# Altium schematic sheet Power Supply Section.SchDoc
size A3
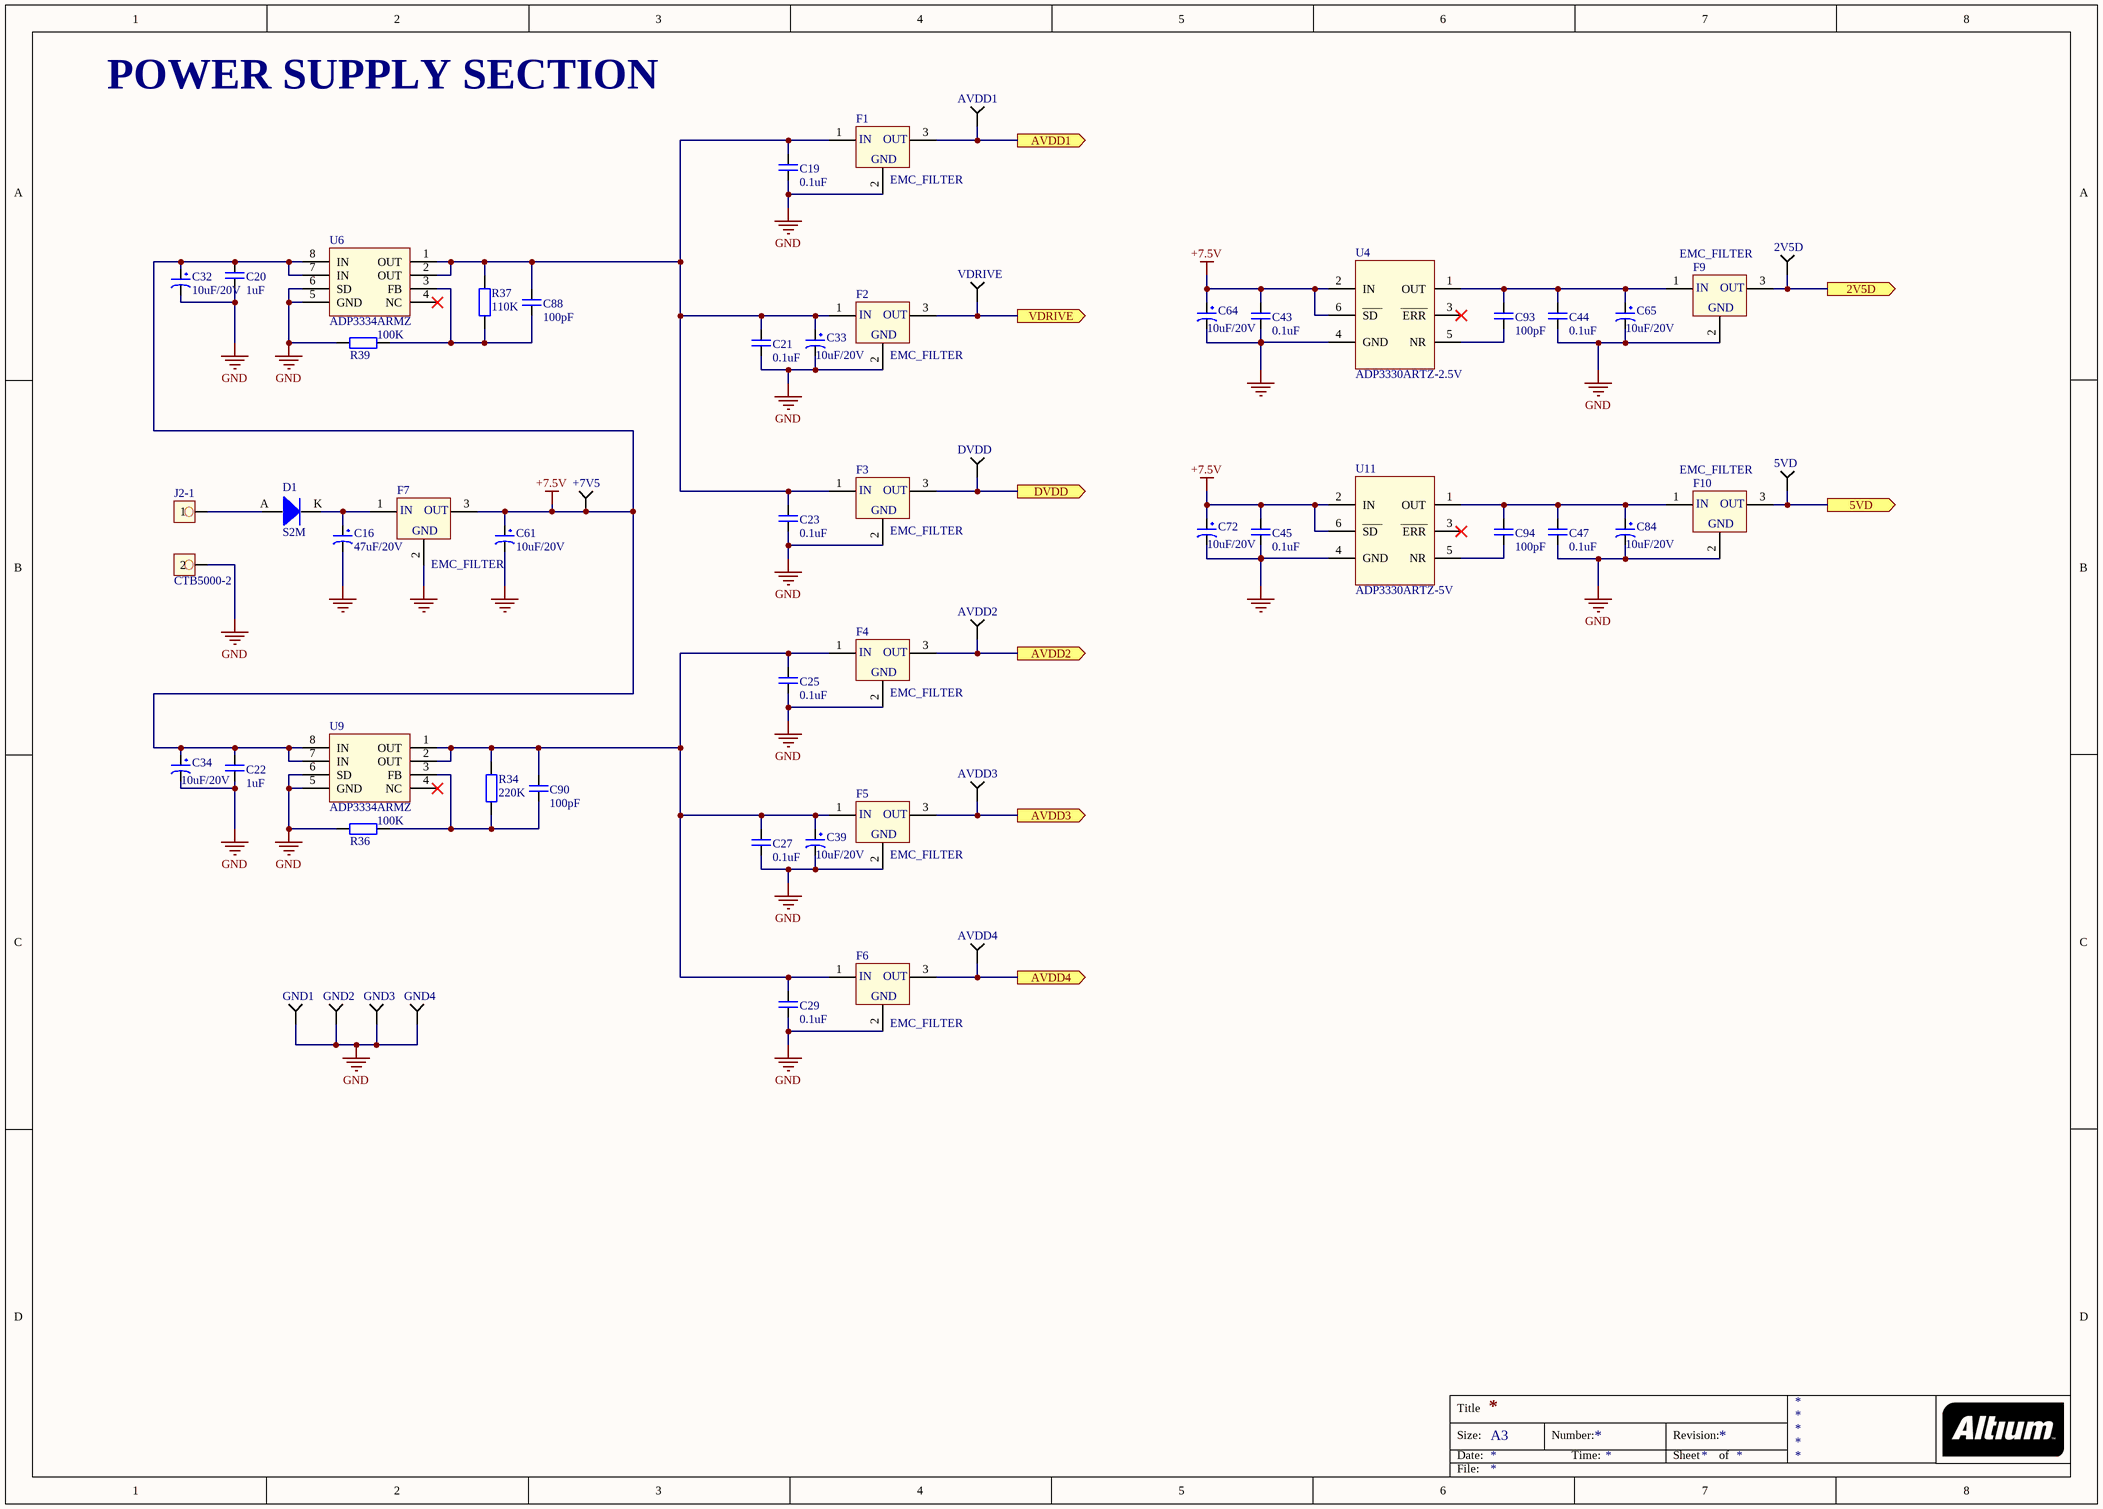
[diagram p0: Power Supply Section.SchDoc]

## Parts
2V5D  Test point  [Test Point]  (value not drawn)
5VD  Test point  [Test Point]  (value not drawn)
+7V5  Test point  [Test Point]  (value not drawn)
AVDD1  Test point  [Test Point]  (value not drawn)
AVDD2  Test point  [Test Point]  (value not drawn)
AVDD3  Test point  [Test Point]  (value not drawn)
AVDD4  Test point  [Test Point]  (value not drawn)
C16  47uF/20V  [C_TANTA_TAJ-D]
C19  0.1uF  [C_0805]
C20  1uF  [C_0805]
C21  0.1uF  [C_0805]
C22  1uF  [C_0805]
C23  0.1uF  [C_0805]
C25  0.1uF  [C_0805]
C27  0.1uF  [C_0805]
C29  0.1uF  [C_0805]
C32  10uF/20V  [C_TANTA_TAJ-B]
C33  10uF/20V  [C_TANTA_TAJ-B]
C34  10uF/20V  [C_TANTA_TAJ-B]
C39  10uF/20V  [C_TANTA_TAJ-B]
C43  0.1uF  [C_0805]
C44  0.1uF  [C_0805]
C45  0.1uF  [C_0805]
C47  0.1uF  [C_0805]
C61  10uF/20V  [C_TANTA_TAJ-B]
C64  10uF/20V  [C_TANTA_TAJ-B]
C65  10uF/20V  [C_TANTA_TAJ-B]
C72  10uF/20V  [C_TANTA_TAJ-B]
C84  10uF/20V  [C_TANTA_TAJ-B]
C88  100pF  [C0603]
C90  100pF  [C0603]
C93  100pF  [C0603]
C94  100pF  [C0603]
D1  S2M  [SS14_AK]
DVDD  Test point  [Test Point]  (value not drawn)
F1  EMC_FILTER  [EMC_FILTER]
F2  EMC_FILTER  [EMC_FILTER]
F3  EMC_FILTER  [EMC_FILTER]
F4  EMC_FILTER  [EMC_FILTER]
F5  EMC_FILTER  [EMC_FILTER]
F6  EMC_FILTER  [EMC_FILTER]
F7  EMC_FILTER  [EMC_FILTER]
F9  EMC_FILTER  [EMC_FILTER]
F10  EMC_FILTER  [EMC_FILTER]
GND1  Test point  [Test Point]  (value not drawn)
GND2  Test point  [Test Point]  (value not drawn)
GND3  Test point  [Test Point]  (value not drawn)
GND4  Test point  [Test Point]  (value not drawn)
J2-1  CTB5000-2  [CTB5000-2]
R34  220K  [R_0603]
R36  100K  [R_0603]
R37  110K  [R_0603]
R39  100K  [R_0603]
U4  ADP3330ARTZ-2.5V  [SOT-23-6]
U6  ADP3334ARMZ  [MSOP-8]
U9  ADP3334ARMZ  [MSOP-8]
U11  ADP3330ARTZ-5V  [SOT-23-6]
VDRIVE  Test point  [Test Point]  (value not drawn)

## Ports
2V5D (out), 5VD (out), AVDD1 (out), AVDD2 (out), AVDD3 (out), AVDD4 (out), DVDD (out), VDRIVE (out)

## Nets
+7.5V: +7V5.1 C20.1 C22.1 C32.1 C34.1 C43.1 C45.1 C61.1 C64.1 C72.1 F7.3(OUT) U4.2(IN) U4.6(SD) U6.7(IN) U6.8(IN) U9.7(IN) U9.8(IN) U11.2(IN) U11.6(SD)
GND: C19.2 C20.2 C21.2 C22.2 C23.2 C25.2 C27.2 C29.2 C32.2 C33.2 C34.2 C39.2 C44.2 C47.2 C65.2 C84.2 F1.2(GND) F2.2(GND) F3.2(GND) F4.2(GND) F5.2(GND) F6.2(GND) F9.2(GND) F10.2(GND) GND1.1 GND2.1 GND3.1 GND4.1 J2-1.2 R36.1 R39.1 U6.5(GND) U6.6(SD) U9.5(GND) U9.6(SD)
NetC16_2: C16.2 C43.2 C45.2 C61.2 C64.2 C72.2 F7.2(GND) U4.4(GND) U11.4(GND)
2V5D: 2V5D.1 F9.3(OUT) ; port 2V5D
5VD: 5VD.1 F10.3(OUT) ; port 5VD
AVDD1: AVDD1.1 F1.3(OUT) ; port AVDD1
AVDD2: AVDD2.1 F4.3(OUT) ; port AVDD2
AVDD3: AVDD3.1 F5.3(OUT) ; port AVDD3
AVDD4: AVDD4.1 F6.3(OUT) ; port AVDD4
DVDD: DVDD.1 F3.3(OUT) ; port DVDD
VDRIVE: F2.3(OUT) VDRIVE.1 ; port VDRIVE
NetC16_1: C16.1 D1.K F7.1(IN)
NetC19_1: C19.1 C21.1 C23.1 C33.1 C88.1 F1.1(IN) F2.1(IN) F3.1(IN) R37.2 U6.1(OUT) U6.2(OUT)
NetC25_1: C25.1 C27.1 C29.1 C39.1 C90.1 F4.1(IN) F5.1(IN) F6.1(IN) R34.2 U9.1(OUT) U9.2(OUT)
NetC44_1: C44.1 C65.1 C93.1 F9.1(IN) U4.1(OUT)
NetC47_1: C47.1 C84.1 C94.1 F10.1(IN) U11.1(OUT)
NetC88_2: C88.2 R37.1 R39.2 U6.3(FB)
NetC90_2: C90.2 R34.1 R36.2 U9.3(FB)
NetC93_2: C93.2 U4.5(NR)
NetC94_2: C94.2 U11.5(NR)
NetD1_A: D1.A J2-1.1

Not connected (* = marked no-connect by the designer): U4 3(ERR)*; U6 4(NC)*; U9 4(NC)*; U11 3(ERR)*

## Notes on the sheet
- POWER SUPPLY SECTION
- Title
- Size:
- Date:
- A3
- Number:
- Time:
- Revision:
- Sheet
- of
- File:

## Library data of the parts
2V5D 5VD +7V5 AVDD1-AVDD4 DVDD GND1-GND4 VDRIVE = Testpoint_PIN: CONN HEADER VERT .100 1POS 30AU; Manufacturer: TE Connectivity AMP Connectors; Manufacturer Part Number: 87220-1; Connector Type: Header, Unshrouded; Number of Positions: 1; Number of Positions Loaded: All; Pitch: 0.100" (2.54mm); Supplier 1: Digi-Key; RoHS: RoHS Compliant; Category: Connectors, Interconnects; Stock 1: 0; Pricing 1: 1=1.1, 25=1.04, 50=0.979, 100=0.847, 500=0.78, 1000=0.611, 2500=0.585 (USD); Packaging: Bulk; Contact Type: Male Pin; Number of Rows: 1; Row Spacing: -; Contact Mating Length: 0.318" (8.08mm); Mounting Type: Through Hole; Termination: Solder; Fastening Type: -; Features: -; Contact Finish: Gold; Contact Finish Thickness: 30µin (0.76µm); Color: Black; ComponentLink1URL: http://www.te.com/commerce/DocumentDelivery/DDEController?Action=srchrtrv&DocNm=87220&DocType=Customer+Drawing&DocLang=English; ComponentLink1Description: http://www.te.com/commerce/DocumentDelivery/DDEController?Action=srchrtrv&DocNm=87220&DocType=Customer+Drawing&DocLang=English; Supplier Part Number 1: A26540-ND
C16 = C_TANTA_47uF_20V: CAP TANT 47UF 20V 10% 2917_TAJ-D; Manufacturer: AVX Corporation; Manufacturer Part Number: TAJD476K020RNJ; Manufacturer Size Code: D; Capacitance: 47µF; ESR (Equivalent Series Resistance): 900 mOhm; Type: Molded; Value: 47uF/20V; Voltage - Rated: 20V; Supplier 1: Digi-Key; RoHS: RoHS Compliant; Category: Capacitors; Stock 1: 8382; Pricing 1: 1=1.07, 10=0.893, 100=0.57, 250=0.475 (USD); Packaging: Cut Tape (CT); Tolerance: ±10%; Operating Temperature: -55°C ~ 125°C; Mounting Type: Surface Mount; Package / Case: 2917 (7343 Metric); Size / Dimension: 0.287" L x 0.169" W (7.30mm x 4.30mm); Height - Seated (Max): 0.122" (3.10mm); Lead Spacing: -; Features: General Purpose; Lifetime @ Temp.: -; ComponentLink1URL: http://www.avx.com/docs/Catalogs/taj.pdf; ComponentLink1Description: http://www.avx.com/docs/Catalogs/taj.pdf; Supplier Part Number 1: 478-3936-1-ND
C19 C21 C23 C25 C27 C29 C43-C45 C47 = C_0.1uF_0805: CAP CER 0.1UF 50V 10% X7R 0805; Manufacturer: MULTICOMP; Manufacturer Part Number: MCU0805R104KCT; Value: 0.1uF/50V; Voltage - Rated: 50V; Supplier 1: Farnell; RoHS: YES; Stock 1: 722514; Pricing 1: 10=0.0642, 100=0.0449, 500=0.0323, 1000=0.0219, 4000=0.0174, 8000=0.014 (GBP); ComponentLink1URL: http://www.farnell.com/datasheets/1859359.pdf; ComponentLink1Description: http://www.farnell.com/datasheets/1859359.pdf; ComponentLink2URL: http://www.farnell.com/cad/1559055.zip; ComponentLink2Description: http://www.farnell.com/cad/1559055.zip; Supplier Part Number 1: 9406387
C20 = C_1uF: CAP CER 1UF 16V 10% X7R 0805; Manufacturer: Murata Electronics North America; Manufacturer Part Number: GRM21BR71C105KA01L; Value: 1uF/16V; Capacitance: 1µF; Supplier 1: Digi-Key; RoHS: RoHS Compliant; Category: Capacitors; Stock 1: 90000; Pricing 1: 3000=0.02139, 6000=0.01957, 9000=0.0182, 15000=0.01729, 30000=0.01638, 75000=0.01502, 150000=0.0124 (USD); Packaging: Tape & Reel (TR); Tolerance: ±10%; Voltage - Rated: 16V; Temperature Coefficient: X7R; Mounting Type: Surface Mount, MLCC; Operating Temperature: -55°C ~ 125°C; Applications: General Purpose; Ratings: -; Package / Case: 0805 (2012 Metric); Size / Dimension: 0.079" L x 0.049" W (2.00mm x 1.25mm); Height - Seated (Max): -; Thickness (Max): 0.053" (1.35mm); Lead Spacing: -; Features: -; Lead Style: -; ComponentLink1URL: http://www.murata.com/~/media/webrenewal/support/library/catalog/products/capacitor/mlcc/c02e.ashx; ComponentLink1Description: http://www.murata.com/~/media/webrenewal/support/library/catalog/products/capacitor/mlcc/c02e.ashx; Supplier Part Number 1: 490-1691-2-ND
C22 = C_1uF_0805: CAP CER 1UF 16V 10% X7R 0805; Manufacturer: Murata Electronics North America; Manufacturer Part Number: GRM21BR71C105KA01L; Value: 1uF/16V; Capacitance: 1µF; Supplier 1: Digi-Key; RoHS: RoHS Compliant; Category: Capacitors; Stock 1: 90000; Pricing 1: 3000=0.02139, 6000=0.01957, 9000=0.0182, 15000=0.01729, 30000=0.01638, 75000=0.01502, 150000=0.0124 (USD); Packaging: Tape & Reel (TR); Tolerance: ±10%; Voltage - Rated: 16V; Temperature Coefficient: X7R; Mounting Type: Surface Mount, MLCC; Operating Temperature: -55°C ~ 125°C; Applications: General Purpose; Ratings: -; Package / Case: 0805 (2012 Metric); Size / Dimension: 0.079" L x 0.049" W (2.00mm x 1.25mm); Height - Seated (Max): -; Thickness (Max): 0.053" (1.35mm); Lead Spacing: -; Features: -; Lead Style: -; ComponentLink1URL: http://www.murata.com/~/media/webrenewal/support/library/catalog/products/capacitor/mlcc/c02e.ashx; ComponentLink1Description: http://www.murata.com/~/media/webrenewal/support/library/catalog/products/capacitor/mlcc/c02e.ashx; Supplier Part Number 1: 490-1691-2-ND
C32-C34 C39 C61 C64 C65 C72 C84 = C_TANTA_10uF_20V: CAP TANT 10UF 20V 10% 1210; Manufacturer: AVX Corporation; Manufacturer Part Number: TAJB106K020RNJ; Manufacturer Size Code: B; Capacitance: 10µF; ESR (Equivalent Series Resistance): 2.1 Ohm; Type: Molded; Value: 10uF/20V; Supplier 1: Digi-Key; RoHS: RoHS Compliant; Category: Capacitors; Stock 1: 78000; Pricing 1: 2000=0.16, 4000=0.15, 10000=0.14, 14000=0.1375, 50000=0.13, 100000=0.125 (USD); Packaging: Tape & Reel (TR); Tolerance: ±10%; Voltage - Rated: 20V; Operating Temperature: -55°C ~ 125°C; Mounting Type: Surface Mount; Package / Case: 1210 (3528 Metric); Size / Dimension: 0.138" L x 0.110" W (3.50mm x 2.80mm); Height - Seated (Max): 0.083" (2.10mm); Lead Spacing: -; Features: General Purpose; Lifetime @ Temp.: -; ComponentLink1URL: http://www.avx.com/docs/Catalogs/taj.pdf; ComponentLink1Description: http://www.avx.com/docs/Catalogs/taj.pdf; Supplier Part Number 1: 478-1674-2-ND
C88 C90 C93 C94 = C_100pF_0603: CAP CER 100PF 50V 5% NP0 0603; Manufacturer: MULTICOMP; Manufacturer Part Number: MCU0603C101JCT; Value: 100pF/50V; Capacitance: 100; Dielectric Characteristic: C0G / NP0; Voltage Rating: 50; Ceramic Capacitor Case: 0603 [1608 Metric]; SVHC: No SVHC (15-Jun-2015); Capacitor Terminals: SMD; Voltage - Rated: 50V; Supplier 1: Farnell; RoHS: YES; Stock 1: 203451; Pricing 1: 10=0.0231, 100=0.015, 500=0.0105, 1000=0.0081, 4000=0.0068, 8000=0.0058 (GBP); Product Range: -; Capacitance Tolerance: ± 5%; Operating Temperature Min: -55; Operating Temperature Max: 125; Packaging: Cut Tape; MSL: -; Capacitance Tolerance ±: ± 5%; Operating Temperature Range: -55°C to +125; ComponentLink1URL: http://www.farnell.com/datasheets/1723231.pdf; ComponentLink1Description: http://www.farnell.com/datasheets/1723231.pdf; Supplier Part Number 1: 9406115
D1 = D_S2M: DIODE GEN PURP 1KV 2A DO214AA; Manufacturer: Fairchild Semiconductor; Value: 2A/DO214AA; Diode Type: Standard; Voltage - DC Reverse (Vr) (Max): 1000V (1kV); Voltage - Forward (Vf) (Max) @ If: 1.15V @ 2A; Speed: Standard Recovery >500ns, > 200mA (Io); Reverse Recovery Time (trr): 2µs; Current - Reverse Leakage @ Vr: 1µA @ 1000V; Capacitance @ Vr, F: 30pF @ 4V, 1MHz; Supplier 1: Digi-Key; Manufacturer Part Number: S2M; RoHS: RoHS Compliant; Category: Discrete Semiconductor Products; Stock 1: 14925; Pricing 1: 1=0.56, 10=0.406, 25=0.3156, 100=0.2391, 250=0.16908, 500=0.13534, 1000=0.10381 (USD); Packaging: Digi-Reel®; Current - Average Rectified (Io): 2A; Mounting Type: Surface Mount; Package / Case: DO-214AA, SMB; Supplier Device Package: DO-214AA (SMB); Operating Temperature - Junction: -65°C ~ 150°C; ComponentLink1URL: http://www.fairchildsemi.com/datasheets/S2/S2A.pdf; ComponentLink1Description: http://www.fairchildsemi.com/datasheets/S2/S2A.pdf; Supplier Part Number 1: S2MFSDKR-ND
F1-F7 F9 F10 = EMC_FILTER: FILTER LC HIGH FREQ 1000PF 2606; Manufacturer: Murata Electronics North America; Manufacturer Part Number: NFE61PT102E1H9L; Type: Low Pass; Number of Channels: 1; Current: 2A; Values: C = 1000pF; ESD Protection: No; Filter Order: 2nd; Supplier 1: Digi-Key; RoHS: RoHS Compliant; Category: Filters; Stock 1: 24285; Pricing 1: 1=0.71, 10=0.681, 25=0.6588, 50=0.538, 100=0.483, 250=0.43912, 500=0.41716, 1000=0.37325 (USD); Packaging: Cut Tape (CT); Technology: LC (T-Type); Center / Cutoff Frequency: -; Attenuation Value: -; Resistance - Channel (Ohms): -; Applications: General Purpose; Package / Case: 2706 (6816 Metric), 3 PC Pad; Size / Dimension: 0.268" L x 0.063" W (6.80mm x 1.60mm); Height: 0.075" (1.90mm); Operating Temperature: -40°C ~ 85°C; ComponentLink1URL: http://www.murata.com/en-sg/products/productdata/ENFE0003.pdf?context=bWFzdGVyfE0wM1h8MTY2NTY1fGFwcGxpY2F0aW9uL3BkZnxzeXMtbWFzdGVyL00wM1gvaGI2L2hkOC84Nzk2MzQwNDIwNjM4L0VORkUwMDAzLnBkZnxjMWNlOTY5YWIyMTllYmFlYmYxMzUyZGE0MWEzYzljNGU2ZTUwYmU1MzU5MTg0ZTlhY2Y2M; ComponentLink1Description: http://www.murata.com/en-sg/products/productdata/ENFE0003.pdf?context=bWFzdGVyfE0wM1h8MTY2NTY1fGFwcGxpY2F0aW9uL3BkZnxzeXMtbWFzdGVyL00wM1gvaGI2L2hkOC84Nzk2MzQwNDIwNjM4L0VORkUwMDAzLnBkZnxjMWNlOTY5YWIyMTllYmFlYmYxMzUyZGE0MWEzYzljNGU2ZTUwYmU1MzU5MTg0ZTlhY2Y2M; Supplier Part Number 1: 490-2553-1-ND
J2-1 = HEADER_2: TERMINAL BLOCK, WIRE TO BRD, 2POS, 14AWG; Manufacturer: CAMDENBOSS; Manufacturer Part Number: CTB5000/2; Connector Type: Terminal Block, PCB; Connector Mounting: PCB; Pitch Spacing: 5; SVHC: No SVHC (17-Dec-2014); Block Orientation: Through Hole Right Angle; Conductor Area CSA: 1.5; External Depth: 7.50; External Length / Height: 10; No. of Positions: 2; Pin Diameter: 1; RMS Current (Irms): 16; Rated Voltage: 250; Wire Connection Method: Screw<!--FANDB--><div class="features-and-benefits-container"><div class="features-and-benefits-description"><span class="features-benefits-value">The CTB5000/2 is a 2-pole ultra low profile screw Terminal Block with anti-solder wicking terminals.</span></div><div class="features-and-benefits-list"><ul class="features-and-benefits-list-list"><li class="features-and-benefits-list-item">Test Probe Facility</li><li class="features-and-benefits-list-item">Moulded in Grey UL94-V0 Flame Retardant PC</li><li class="features-and-benefits-list-item">0.5 to 1.0mm² (30 to 14; Supplier 1: Farnell; RoHS: YES; Stock 1: 31858; Pricing 1: 5=0.524, 10=0.273, 50=0.26, 100=0.209, 500=0.18, 1000=0.155, 3000=0.14, 8000=0.122 (GBP); Wire Size AWG Min: -; Wire Size AWG Max: -; Contact Plating: Tin; Contact Material: Brass; Colour: Light Grey; External Width: 5; Flammability Rating: UL94V-0; Height: 10; Operating Temperature Max: 125; Operating Temperature Min: -20; Rated Current: 16; Voltage Rating V AC: 250; Wire Area Size Max: 1.5; ComponentLink1URL: http://www.farnell.com/datasheets/1927438.pdf; ComponentLink1Description: http://www.farnell.com/datasheets/1927438.pdf; Supplier Part Number 1: 151789
R34 = R_0603_220K: RES SMD 220K OHM 1% 1/16W 0603; Manufacturer: MULTICOMP; Manufacturer Part Number: MC0063W06031220K; Value: 220K-1/16W; Product Range: MC Series; Resistance: 220; Power Rating: 63; Voltage Rating: 50; Resistor Case Style: 0603 [1608 Metric]; Temperature Coefficient: ± 100; Reel Quantity: 15000; Resistor Element Material: Thick Film<!--FANDB--><div class="features-and-benefits-container"></div>; Supplier 1: Farnell; RoHS: YES; Stock 1: 1; Pricing 1: 3=1.84 (GBP); Resistance Tolerance: ± 1%; Packaging: Tape & Reel; MSL: -; ComponentLink1URL: http://www.farnell.com/datasheets/1729046.pdf; ComponentLink1Description: http://www.farnell.com/datasheets/1729046.pdf; Supplier Part Number 1: 2357558
R36 R39 = R_0603_100K: RES SMD 100K OHM 1% 1/16W 0603; Manufacturer: MULTICOMP; Manufacturer Part Number: MC0063W06031100K; Value: 100K-1/16W; Supplier 1: Farnell; RoHS: YES; Stock 1: 1639995; Pricing 1: 5000=0.002, 25000=0.0016, 50000=0.001 (GBP); ComponentLink1URL: http://www.farnell.com/datasheets/1788326.pdf; ComponentLink1Description: http://www.farnell.com/datasheets/1788326.pdf; ComponentLink2URL: http://www.farnell.com/datasheets/1944283.pdf; ComponentLink2Description: http://www.farnell.com/datasheets/1944283.pdf; Supplier Part Number 1: 2131019
R37 = R_0603_110K: RES SMD 110K OHM 1% 1/16W 0603; Manufacturer: MULTICOMP; Manufacturer Part Number: MC0063W06031110K; Value: 110K-1/16W; Product Range: MC Series; Resistance: 110; Power Rating: 63; Voltage Rating: 50; Resistor Case Style: 0603 [1608 Metric]; Temperature Coefficient: ± 100; SVHC: No SVHC (17-Dec-2014); Reel Quantity: 5000; Resistor Element Material: Thick Film; Resistor Mounting: SMD<!--FANDB--><div class="features-and-benefits-container"><div class="features-and-benefits-description"><span class="features-benefits-value">The Multicomp MC series current sense resistors are thick film chip resistors. The resistance range includes E96 and E24 decade values from 1ohm to 10Mohm.</span></div><div class="features-and-benefits-list"><ul class="features-and-benefits-list-list"><li class="features-and-benefits-list-item">EIA 0402, 0603, 0805, 1206 chip sizes available</li><li class="features-and-benefits-list-item">Small size and low weight</li><li class="features-and-benefits-list-item">Suitable for both wave and reflow soldering</li><li class="features-and-benefits-list-item">Reduction of assembly costs</li><li class="features-and-benefits-list-item">Maximum working voltage of 50V(0402, 0603), 150V(0805), 200V(1206)</li><li class="features-and-benefits-list-item">Available in ±1%, ±2% and ±5% tolerance</li><li class="features-and-benefits-list-item">Power rating of 62.5mW, 100mW and 125mW</li><li class="features-and-benefits-list-item">±400ppm/°C(1ohm to 10ohm), ±200ppm/°C(11ohm to 100ohm), ±100; Supplier 1: Farnell; RoHS: YES; Stock 1: 69995; Pricing 1: 5000=0.002, 25000=0.0016, 50000=0.001 (GBP); Resistance Tolerance: ± 1%; Packaging: Full Reel; MSL: -; ComponentLink1URL: http://www.farnell.com/datasheets/1788326.pdf; ComponentLink1Description: http://www.farnell.com/datasheets/1788326.pdf; ComponentLink2URL: http://www.farnell.com/datasheets/1944283.pdf; ComponentLink2Description: http://www.farnell.com/datasheets/1944283.pdf; Supplier Part Number 1: 2131022
U4 = ADP3330ARTZ-2.5V: IC REG LDO 2.5V 0.2A SOT23-6; Manufacturer: Analog Devices Inc.; Manufacturer Part Number: ADP3330ARTZ-2.5-R7; Regulator Topology: Positive Fixed; Current - Output: 200mA; Voltage - Dropout (Typical): 0.14V @ 200mA; Number of Regulators: 1; Voltage - Input: 2.9 V ~ 12 V; Supplier 1: Digi-Key; RoHS: RoHS Compliant; Category: Integrated Circuits (ICs); Stock 1: 3000; Pricing 1: 3000=1.05165, 6000=1.0127, 15000=0.984 (USD); Packaging: Tape & Reel (TR); Voltage - Output: 2.5V; Current - Limit (Min): -; Operating Temperature: -40°C ~ 125°C; Mounting Type: Surface Mount; Package / Case: SOT-23-6; Supplier Device Package: SOT-23-6; ComponentLink1URL: http://www.analog.com/media/en/technical-documentation/data-sheets/ADP3330.pdf; ComponentLink1Description: http://www.analog.com/media/en/technical-documentation/data-sheets/ADP3330.pdf; Supplier Part Number 1: ADP3330ARTZ-2.5-R7TR-ND
U6 U9 = ADP3334ARMZ: IC REG LDO ADJ 0.5A 8MSOP; Manufacturer: Analog Devices Inc; Manufacturer Part Number: ADP3334ARMZ-REEL; Regulator Topology: Positive Adjustable; Voltage - Output: 1.5 V ~ 10 V; Current - Output: 500mA; Voltage - Dropout (Typical): 0.2V @ 500mA; Number of Regulators: 1; Voltage - Input: 2.6 V ~ 11 V; Supplier 1: Digi-Key; RoHS: RoHS Compliant; Category: Integrated Circuits (ICs); Stock 1: 63; Pricing 1: 1=2.64, 10=2.38, 25=2.1324, 100=1.9175, 250=1.7026, 500=1.4877, 1000=1.23149 (USD); Packaging: Cut Tape (CT); Current - Limit (Min): -; Operating Temperature: -40°C ~ 150°C; Mounting Type: Surface Mount; Package / Case: 8-TSSOP, 8-MSOP (0.118", 3.00mm Width); Supplier Device Package: 8-MSOP; ComponentLink1URL: http://www.analog.com/media/en/technical-documentation/data-sheets/ADP3334.pdf; ComponentLink1Description: http://www.analog.com/media/en/technical-documentation/data-sheets/ADP3334.pdf; Supplier Part Number 1: ADP3334ARMZ-REELCT-ND
U11 = ADP3330ARTZ-5V: IC REG LDO 5V 0.2A SOT23-6; Manufacturer: Analog Devices Inc.; Manufacturer Part Number: ADP3330ARTZ-5-RL7; Regulator Topology: Positive Fixed; Current - Output: 200mA; Voltage - Dropout (Typical): 0.14V @ 200mA; Number of Regulators: 1; Voltage - Input: Up to 12V; Supplier 1: Digi-Key; RoHS: RoHS Compliant; Category: Integrated Circuits (ICs); Stock 1: 0; Pricing 1: 3000=1.05165, 6000=1.0127, 15000=0.984 (USD); Packaging: Tape & Reel (TR); Voltage - Output: 5V; Current - Limit (Min): -; Operating Temperature: -40°C ~ 125°C; Mounting Type: Surface Mount; Package / Case: SOT-23-6; Supplier Device Package: SOT-23-6; ComponentLink1URL: http://www.analog.com/media/en/technical-documentation/data-sheets/ADP3330.pdf; ComponentLink1Description: http://www.analog.com/media/en/technical-documentation/data-sheets/ADP3330.pdf; Supplier Part Number 1: ADP3330ARTZ-5-RL7TR-ND